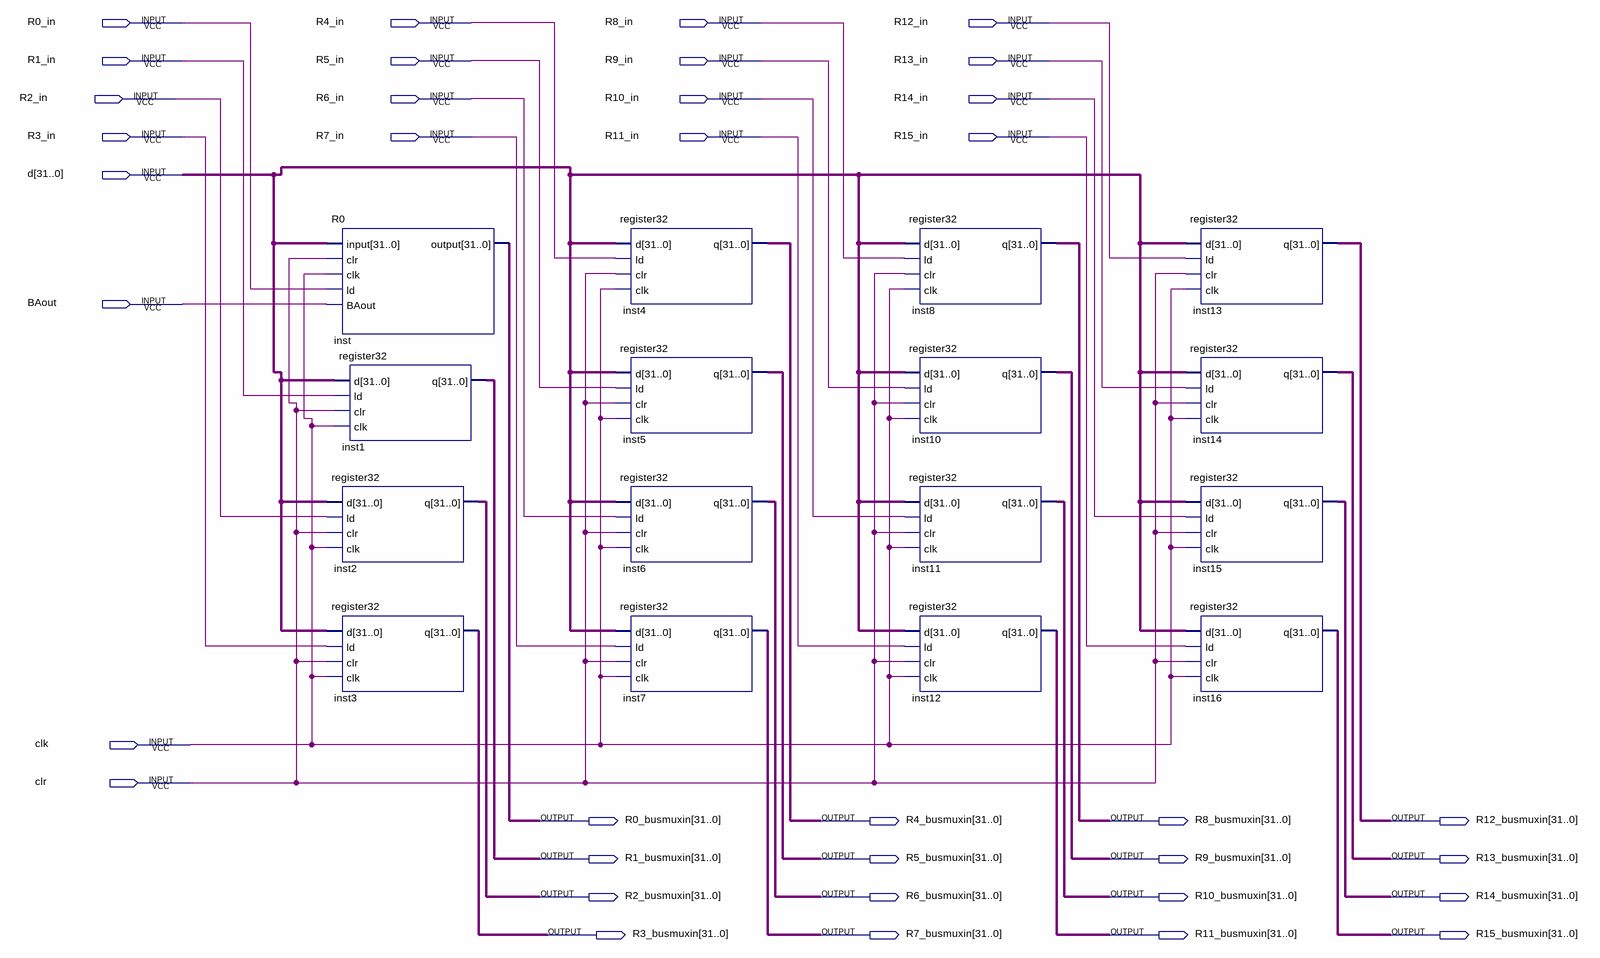
[diagram p0: schematic sheet]
// Quartus schematic GPRegisterBlock.bdf as structural Verilog: 16 symbols, 36 pins
module GPRegisterBlock (
  input  R0_in,
  input  R4_in,
  input  R8_in,
  input  R12_in,
  input  R1_in,
  input  R5_in,
  input  R9_in,
  input  R13_in,
  input  R2_in,
  input  R6_in,
  input  R10_in,
  input  R14_in,
  input  R3_in,
  input  R7_in,
  input  R11_in,
  input  R15_in,
  input  [31:0] d,
  input  BAout,
  input  clk,
  input  clr,
  output [31:0] R0_busmuxin,
  output [31:0] R4_busmuxin,
  output [31:0] R8_busmuxin,
  output [31:0] R12_busmuxin,
  output [31:0] R1_busmuxin,
  output [31:0] R5_busmuxin,
  output [31:0] R9_busmuxin,
  output [31:0] R13_busmuxin,
  output [31:0] R2_busmuxin,
  output [31:0] R6_busmuxin,
  output [31:0] R10_busmuxin,
  output [31:0] R14_busmuxin,
  output [31:0] R3_busmuxin,
  output [31:0] R7_busmuxin,
  output [31:0] R11_busmuxin,
  output [31:0] R15_busmuxin
);

  R0 inst (.\input (d), .clr(clr), .clk(clk), .ld(R0_in), .BAout(BAout), .\output (R0_busmuxin));
  register32 inst1 (.d(d), .ld(R1_in), .clr(clr), .clk(clk), .q(R1_busmuxin));
  register32 inst2 (.d(d), .ld(R2_in), .clr(clr), .clk(clk), .q(R2_busmuxin));
  register32 inst3 (.d(d), .ld(R3_in), .clr(clr), .clk(clk), .q(R3_busmuxin));
  register32 inst4 (.d(d), .ld(R4_in), .clr(clr), .clk(clk), .q(R4_busmuxin));
  register32 inst5 (.d(d), .ld(R5_in), .clr(clr), .clk(clk), .q(R5_busmuxin));
  register32 inst6 (.d(d), .ld(R6_in), .clr(clr), .clk(clk), .q(R6_busmuxin));
  register32 inst7 (.d(d), .ld(R7_in), .clr(clr), .clk(clk), .q(R7_busmuxin));
  register32 inst8 (.d(d), .ld(R8_in), .clr(clr), .clk(clk), .q(R8_busmuxin));
  register32 inst10 (.d(d), .ld(R9_in), .clr(clr), .clk(clk), .q(R9_busmuxin));
  register32 inst11 (.d(d), .ld(R10_in), .clr(clr), .clk(clk), .q(R10_busmuxin));
  register32 inst12 (.d(d), .ld(R11_in), .clr(clr), .clk(clk), .q(R11_busmuxin));
  register32 inst13 (.d(d), .ld(R12_in), .clr(clr), .clk(clk), .q(R12_busmuxin));
  register32 inst14 (.d(d), .ld(R13_in), .clr(clr), .clk(clk), .q(R13_busmuxin));
  register32 inst15 (.d(d), .ld(R14_in), .clr(clr), .clk(clk), .q(R14_busmuxin));
  register32 inst16 (.d(d), .ld(R15_in), .clr(clr), .clk(clk), .q(R15_busmuxin));
endmodule
